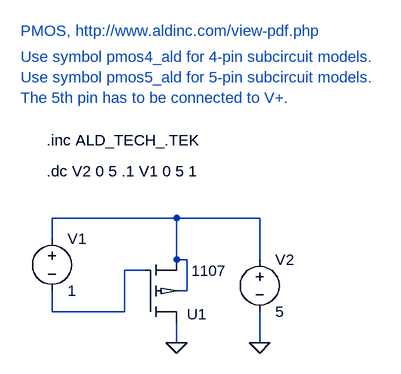
[diagram p0: schematic ALD_pmos_1107.asc]
ALD_pmos_1107.asc, the LTspice schematic file:
Version 4
SHEET 1 880 680
WIRE 176 48 -16 48
WIRE 304 48 176 48
WIRE -16 80 -16 48
WIRE 176 112 176 48
WIRE 192 112 176 112
WIRE 304 112 304 48
WIRE 128 128 96 128
WIRE 192 160 192 112
WIRE 192 160 176 160
WIRE -16 192 -16 160
WIRE 96 192 96 128
WIRE 96 192 -16 192
WIRE 176 240 176 208
WIRE 304 240 304 192
FLAG 176 240 0
FLAG 304 240 0
SYMBOL voltage 304 96 R0
SYMATTR InstName V2
SYMATTR Value 5
SYMBOL voltage -16 64 R0
SYMATTR InstName V1
SYMATTR Value 1
SYMBOL pmos4_ald 128 208 M180
WINDOW 3 71 79 Left 2
SYMATTR Value 1107
SYMATTR InstName U1
TEXT -24 -24 Left 2 !.dc V2 0 5 .1 V1 0 5 1
TEXT -24 -72 Left 2 !.inc ALD_TECH_.TEK
TEXT -64 -240 Left 2 ;PMOS, http://www.aldinc.com/view-pdf.php
TEXT -64 -200 Left 2 ;Use symbol pmos4_ald for 4-pin subcircuit models.\nUse symbol pmos5_ald for 5-pin subcircuit models. \nThe 5th pin has to be connected to V+.

The netlist it stands for:
* ALD_pmos_1107.asc
V2 N001 0 5
V1 N001 N002 1
XU1 0 N002 N001 N001 1107  ; pins D G S B
.dc V2 0 5 .1 V1 0 5 1
.inc ALD_TECH_.TEK
* PMOS, http://www.aldinc.com/view-pdf.php
* Use symbol pmos4_ald for 4-pin subcircuit models.
* Use symbol pmos5_ald for 5-pin subcircuit models.
* The 5th pin has to be connected to V+.
.backanno
.end